# EAGLE schematic TRS-80 (EAGLE 6.6.0)
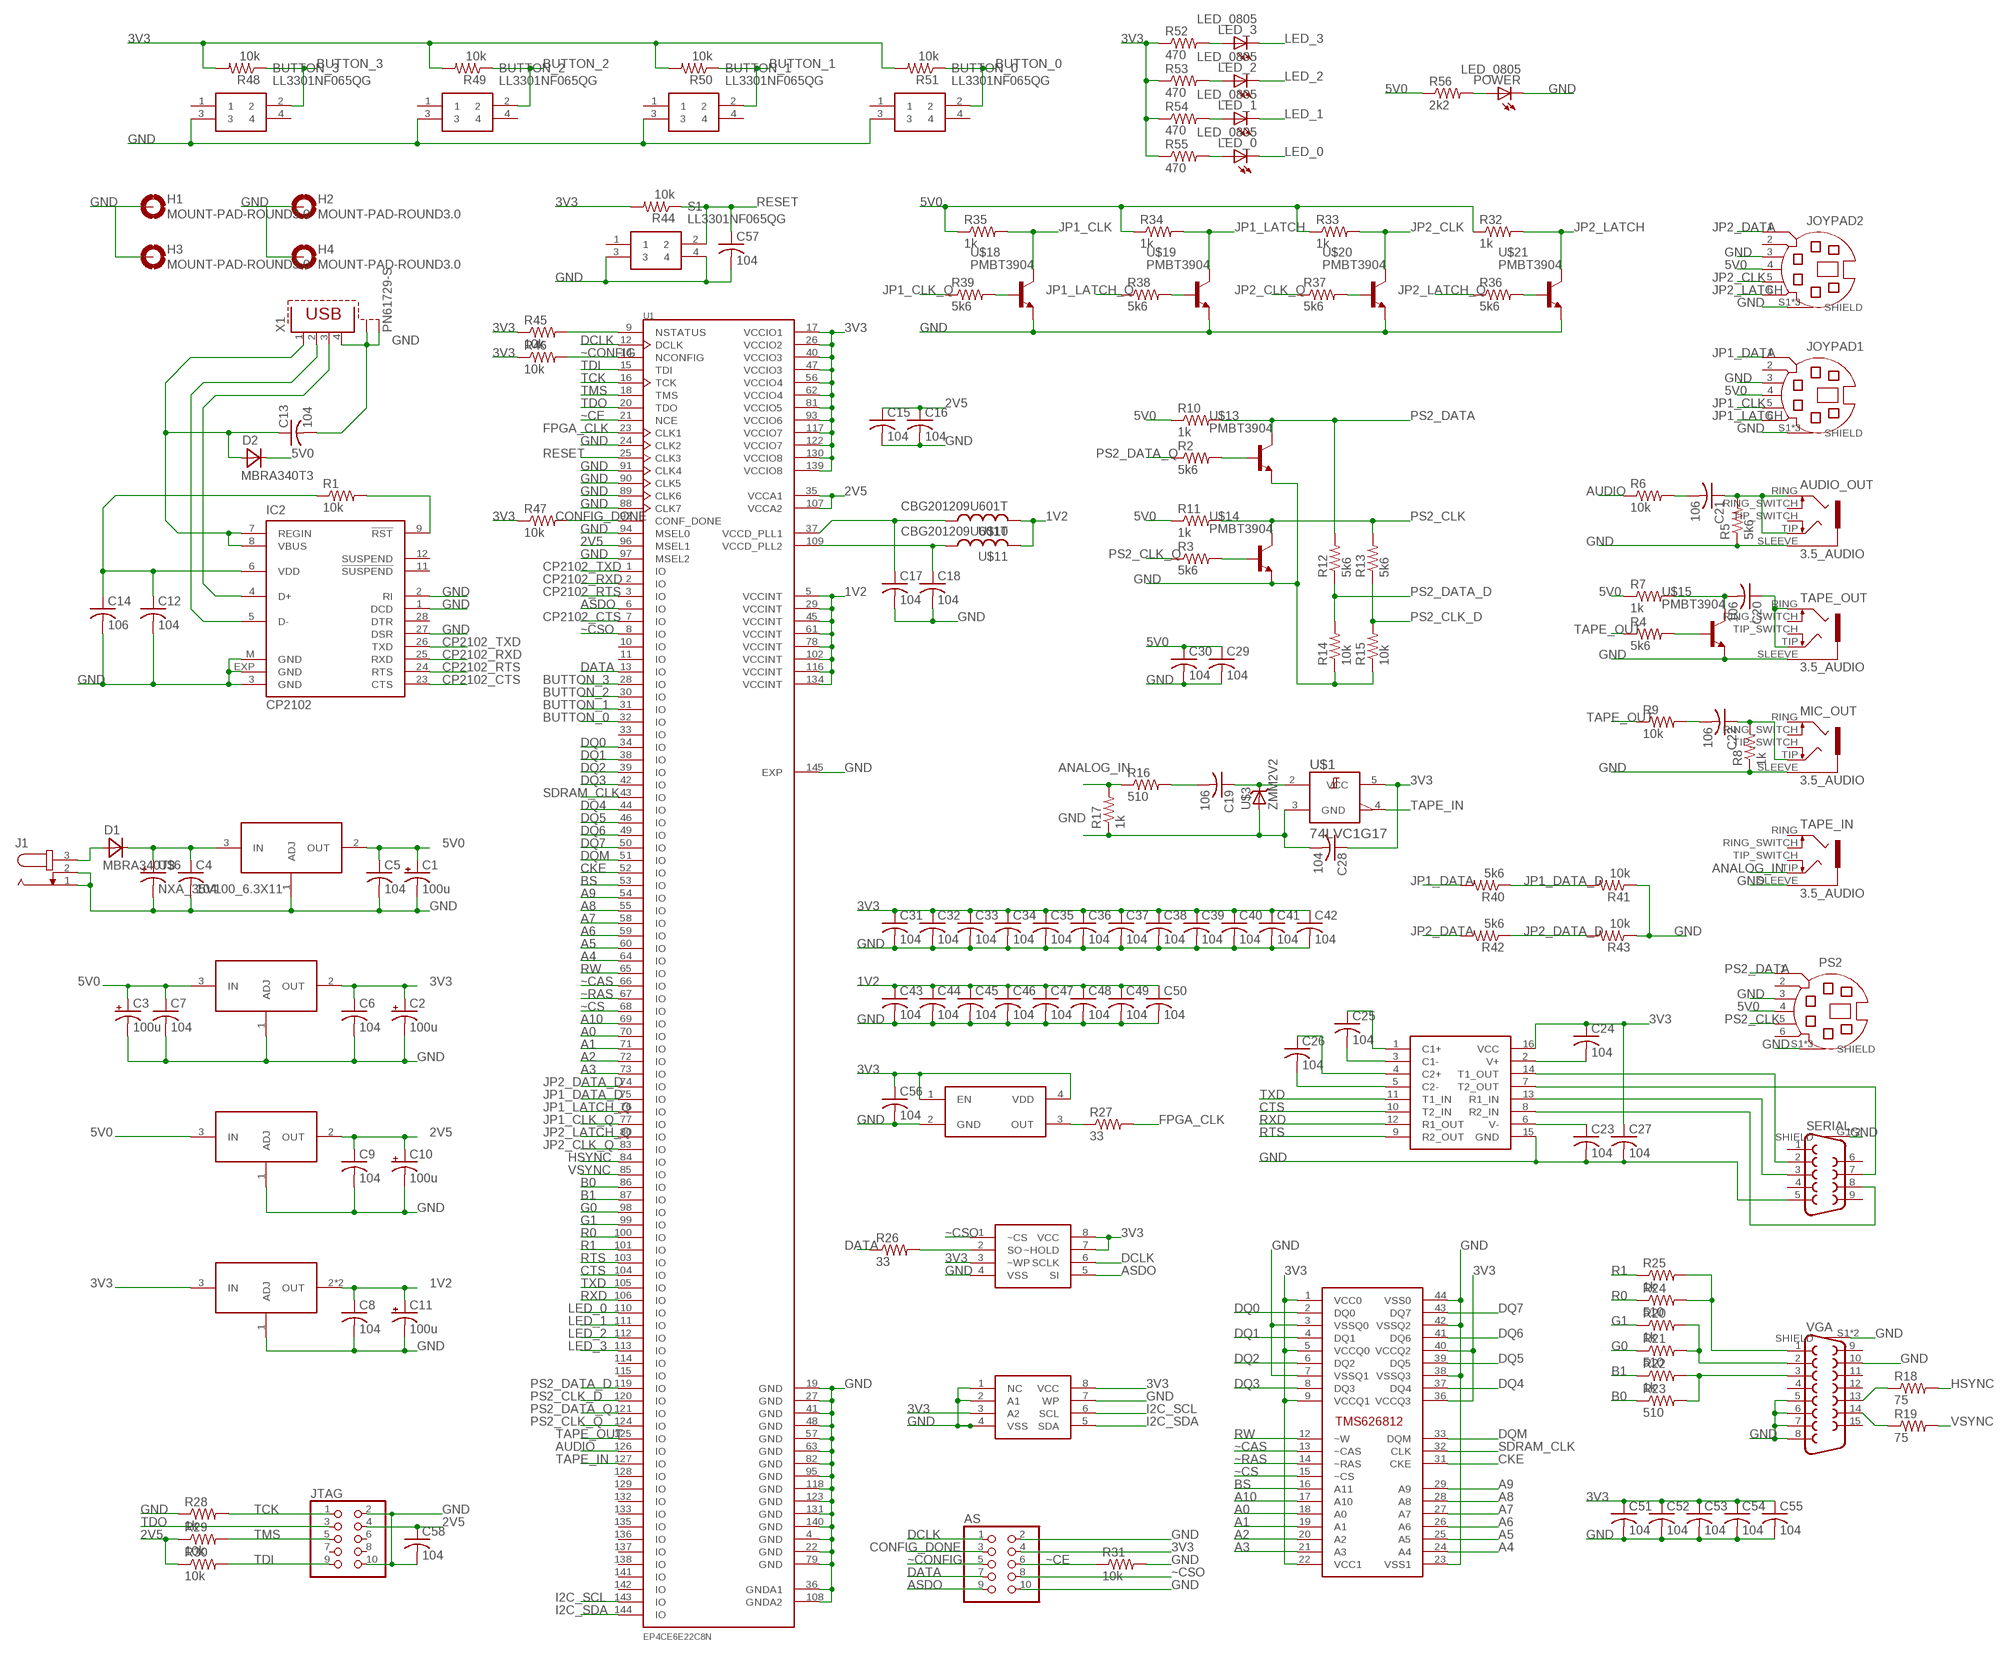
[diagram p0: schematic, sheet 1]

## Parts
AS  PINHD-2X5  [2X05]
AUDIO_OUT  3.5_AUDIO  [3.5_AUDIO]
BUTTON_0  LL3301NF065QG  [LL3301NF065QG]
BUTTON_1  LL3301NF065QG  [LL3301NF065QG]
BUTTON_2  LL3301NF065QG  [LL3301NF065QG]
BUTTON_3  LL3301NF065QG  [LL3301NF065QG]
C1  100u  CPOL-USUD-6,3X5,8  [UD-6,3X5,8_NICHICON]
C2  100u  CPOL-USUD-6,3X5,8  [UD-6,3X5,8_NICHICON]
C3  100u  CPOL-USUD-6,3X5,8  [UD-6,3X5,8_NICHICON]
C4  104  C-USC0805  [C0805]
C5  104  C-USC0805  [C0805]
C6  104  C-USC0805  [C0805]
C7  104  C-USC0805  [C0805]
C8  104  C-USC0805  [C0805]
C9  104  C-USC0805  [C0805]
C10  100u  CPOL-USUD-6,3X5,8  [UD-6,3X5,8_NICHICON]
C11  100u  CPOL-USUD-6,3X5,8  [UD-6,3X5,8_NICHICON]
C12  104  C-USC0805  [C0805]
C13  104  C-USC0805  [C0805]
C14  106  C-USC1206  [C1206]
C15  104  C-USC0805  [C0805]
C16  104  C-USC0805  [C0805]
C17  104  C-USC0805  [C0805]
C18  104  C-USC0805  [C0805]
C19  106  C-USC1206  [C1206]
C20  106  C-USC1206  [C1206]
C21  106  C-USC1206  [C1206]
C22  106  C-USC1206  [C1206]
C23  104  C-USC0805  [C0805]
C24  104  C-USC0805  [C0805]
C25  104  C-USC0805  [C0805]
C26  104  C-USC0805  [C0805]
C27  104  C-USC0805  [C0805]
C28  104  C-USC0805  [C0805]
C29  104  C-USC0805  [C0805]
C30  104  C-USC0805  [C0805]
C31  104  C-USC0805  [C0805]
C32  104  C-USC0805  [C0805]
C33  104  C-USC0805  [C0805]
C34  104  C-USC0805  [C0805]
C35  104  C-USC0805  [C0805]
C36  104  C-USC0805  [C0805]
C37  104  C-USC0805  [C0805]
C38  104  C-USC0805  [C0805]
C39  104  C-USC0805  [C0805]
C40  104  C-USC0805  [C0805]
C41  104  C-USC0805  [C0805]
C42  104  C-USC0805  [C0805]
C43  104  C-USC0805  [C0805]
C44  104  C-USC0805  [C0805]
C45  104  C-USC0805  [C0805]
C46  104  C-USC0805  [C0805]
C47  104  C-USC0805  [C0805]
C48  104  C-USC0805  [C0805]
C49  104  C-USC0805  [C0805]
C50  104  C-USC0805  [C0805]
C51  104  C-USC0805  [C0805]
C52  104  C-USC0805  [C0805]
C53  104  C-USC0805  [C0805]
C54  104  C-USC0805  [C0805]
C55  104  C-USC0805  [C0805]
C56  104  C-USC0805  [C0805]
C57  104  C-USC0805  [C0805]
C58  104  C-USC0805  [C0805]
D1  MBRA340T3  [SMA]
D2  MBRA340T3  [SMA]
H1  MOUNT-PAD-ROUND3.0  [3,0-PAD]
H2  MOUNT-PAD-ROUND3.0  [3,0-PAD]
H3  MOUNT-PAD-ROUND3.0  [3,0-PAD]
H4  MOUNT-PAD-ROUND3.0  [3,0-PAD]
IC2  CP2102  [MLP28]
J1  JACK-PLUG1  [SPC4078]
JOYPAD1  MD06SS  [MDIN06SS]
JOYPAD2  MD06SS  [MDIN06SS]
JTAG  PINHD-2X5  [2X05]
LED_0  LED_0805  [CHIP-LED0805]
LED_1  LED_0805  [CHIP-LED0805]
LED_2  LED_0805  [CHIP-LED0805]
LED_3  LED_0805  [CHIP-LED0805]
MIC_OUT  3.5_AUDIO  [3.5_AUDIO]
POWER  LED_0805  [CHIP-LED0805]
PS2  MD06SS  [MDIN06SS]
R1  10k  R-US_R0805  [R0805]
R2  5k6  R-US_R0805  [R0805]
R3  5k6  R-US_R0805  [R0805]
R4  5k6  R-US_R0805  [R0805]
R5  5k6  R-US_R0805  [R0805]
R6  10k  R-US_R0805  [R0805]
R7  1k  R-US_R0805  [R0805]
R8  1k  R-US_R0805  [R0805]
R9  10k  R-US_R0805  [R0805]
R10  1k  R-US_R0805  [R0805]
R11  1k  R-US_R0805  [R0805]
R12  5k6  R-US_R0805  [R0805]
R13  5k6  R-US_R0805  [R0805]
R14  10k  R-US_R0805  [R0805]
R15  10k  R-US_R0805  [R0805]
R16  510  R-US_R0805  [R0805]
R17  1k  R-US_R0805  [R0805]
R18  75  R-US_R0805  [R0805]
R19  75  R-US_R0805  [R0805]
R20  1k  R-US_R0805  [R0805]
R21  510  R-US_R0805  [R0805]
R22  1k  R-US_R0805  [R0805]
R23  510  R-US_R0805  [R0805]
R24  510  R-US_R0805  [R0805]
R25  1k  R-US_R0805  [R0805]
R26  33  R-US_R0805  [R0805]
R27  33  R-US_R0805  [R0805]
R28  1k  R-US_R0805  [R0805]
R29  10k  R-US_R0805  [R0805]
R30  10k  R-US_R0805  [R0805]
R31  10k  R-US_R0805  [R0805]
R32  1k  R-US_R0805  [R0805]
R33  1k  R-US_R0805  [R0805]
R34  1k  R-US_R0805  [R0805]
R35  1k  R-US_R0805  [R0805]
R36  5k6  R-US_R0805  [R0805]
R37  5k6  R-US_R0805  [R0805]
R38  5k6  R-US_R0805  [R0805]
R39  5k6  R-US_R0805  [R0805]
R40  5k6  R-US_R0805  [R0805]
R41  10k  R-US_R0805  [R0805]
R42  5k6  R-US_R0805  [R0805]
R43  10k  R-US_R0805  [R0805]
R44  10k  R-US_R0805  [R0805]
R45  10k  R-US_R0805  [R0805]
R46  10k  R-US_R0805  [R0805]
R47  10k  R-US_R0805  [R0805]
R48  10k  R-US_R0805  [R0805]
R49  10k  R-US_R0805  [R0805]
R50  10k  R-US_R0805  [R0805]
R51  10k  R-US_R0805  [R0805]
R52  470  R-US_R0805  [R0805]
R53  470  R-US_R0805  [R0805]
R54  470  R-US_R0805  [R0805]
R55  470  R-US_R0805  [R0805]
R56  2k2  R-US_R0805  [R0805]
S1  LL3301NF065QG  [LL3301NF065QG]
SERIAL  F09HP  [F09HP]
TAPE_IN  3.5_AUDIO  [3.5_AUDIO]
TAPE_OUT  3.5_AUDIO  [3.5_AUDIO]
U1  EP4CE6E22C8N  [QFP50P2200X2200X165-145N]
U$1  74LVC1G17  [SOT353]
U$2  TMS626812  [TSOP44-II]
U$3  ZMM2V2  [SOD80C]
U$4  SP232  [SOP16]
U$5  LM1086  [D2PACK]
U$6  NXA_35V100_6.3X11  [NXA_35V100_6.3X11]
U$7  LD1117D-3.3  [TO252]
U$8  KIA1117-2.5  [SOT223]
U$9  AZ1117H-1.2TRG1  [SOT223]
U$10  CBG201209U601T  [C0805]
U$11  CBG201209U601T  [C0805]
U$12  OT705050MJBA4SL  [ASV32000MHZET]
U$13  PMBT3904  [SOT23]
U$14  PMBT3904  [SOT23]
U$15  PMBT3904  [SOT23]
U$16  BY25Q16BS  [SO08]
U$17  CAT24M01WI-GT3  [SO08]
U$18  PMBT3904  [SOT23]
U$19  PMBT3904  [SOT23]
U$20  PMBT3904  [SOT23]
U$21  PMBT3904  [SOT23]
VGA  F15HDH  [HDF15H]
X1  PN61729-S  [PN61729-S]

## Nets
1V2: C8.1 C11.+ C43.1 C44.1 C45.1 C46.1 C47.1 C48.1 C49.1 C50.1 U1.5(VCCINT) U1.29(VCCINT) U1.45(VCCINT) U1.61(VCCINT) U1.78(VCCINT) U1.102(VCCINT) U1.116(VCCINT) U1.134(VCCINT) U$9.2(OUT) U$9.4(OUT) U$10.2 U$11.2
2V5: C9.1 C10.+ C15.1 C16.1 C58.1 JTAG.4 R29.1 R30.1 U1.35(VCCA1) U1.96(MSEL1) U1.107(VCCA2) U$8.2(OUT)
3V3: AS.4 C2.+ C6.1 C24.1 C27.1 C28.1 C31.1 C32.1 C33.1 C34.1 C35.1 C36.1 C37.1 C38.1 C39.1 C40.1 C41.1 C42.1 C51.1 C52.1 C53.1 C54.1 C55.1 C56.1 R44.2 R45.1 R46.1 R47.1 R48.2 R49.2 R50.2 R51.2 R52.1 R53.1 R54.1 R55.1 U1.17(VCCIO1) U1.26(VCCIO2) U1.40(VCCIO3) U1.47(VCCIO3) U1.56(VCCIO4) U1.62(VCCIO4) U1.81(VCCIO5) U1.93(VCCIO6) U1.117(VCCIO7) U1.122(VCCIO7) U1.130(VCCIO8) U1.139(VCCIO8) U$1.5(VCC) U$2.1(VCC0) U$2.5(VCCQ0) U$2.9(VCCQ1) U$2.22(VCC1) U$2.36(VCCQ3) U$2.40(VCCQ2) U$4.16(VCC) U$7.2(OUT) U$9.3(IN) U$12.1(EN) U$12.4(VDD) U$16.3(~WP) U$16.7(~HOLD) U$16.8(VCC) U$17.3(A2) U$17.8(VCC)
5V0: C1.+ C3.+ C5.1 C7.1 C29.1 C30.1 D2.C JOYPAD1.4 JOYPAD2.4 PS2.4 R7.1 R10.1 R11.1 R32.1 R33.1 R34.1 R35.1 R56.1 U$5.2(OUT) U$7.3(IN) U$8.3(IN)
A0: U1.70(IO) U$2.18(A0)
A1: U1.71(IO) U$2.19(A1)
A2: U1.72(IO) U$2.20(A2)
A3: U1.73(IO) U$2.21(A3)
A4: U1.64(IO) U$2.24(A4)
A5: U1.60(IO) U$2.25(A5)
A6: U1.59(IO) U$2.26(A6)
A7: U1.58(IO) U$2.27(A7)
A8: U1.55(IO) U$2.28(A8)
A9: U1.54(IO) U$2.29(A9)
A10: U1.69(IO) U$2.17(A10)
ANALOG_IN: R16.1 R17.2 TAPE_IN.TIP
ASDO: AS.9 U1.6(IO) U$16.5(SI)
AUDIO: R6.1 U1.126(IO)
B0: R23.1 U1.86(IO)
B1: R22.1 U1.87(IO)
BS: U1.53(IO) U$2.16(A11)
BUTTON_0: BUTTON_0.2 R51.1 U1.32(IO)
BUTTON_1: BUTTON_1.2 R50.1 U1.31(IO)
BUTTON_2: BUTTON_2.2 R49.1 U1.30(IO)
BUTTON_3: BUTTON_3.2 R48.1 U1.28(IO)
CKE: U1.52(IO) U$2.31(CKE)
CONFIG_DONE: AS.3 R47.2 U1.92(CONF_DONE)
CP2102_CTS: IC2.23(CTS) U1.7(IO)
CP2102_RTS: IC2.24(RTS) U1.3(IO)
CP2102_RXD: IC2.25(RXD) U1.2(IO)
CP2102_TXD: IC2.26(TXD) U1.1(IO)
CTS: U1.104(IO) U$4.10(T2_IN)
DATA: AS.7 R26.1 U1.13(IO)
DCLK: AS.1 U1.12(DCLK) U$16.6(SCLK)
DQ0: U1.34(IO) U$2.2(DQ0)
DQ1: U1.38(IO) U$2.4(DQ1)
DQ2: U1.39(IO) U$2.6(DQ2)
DQ3: U1.42(IO) U$2.8(DQ3)
DQ4: U1.44(IO) U$2.37(DQ4)
DQ5: U1.46(IO) U$2.39(DQ5)
DQ6: U1.49(IO) U$2.41(DQ6)
DQ7: U1.50(IO) U$2.43(DQ7)
DQM: U1.51(IO) U$2.33(DQM)
FPGA_CLK: R27.2 U1.23(CLK1)
G0: R21.1 U1.98(IO)
G1: R20.1 U1.99(IO)
GND: AS.2 AS.10 AUDIO_OUT.SLEEVE BUTTON_0.3 BUTTON_1.3 BUTTON_2.3 BUTTON_3.3 C1.- C2.- C3.- C4.2 C5.2 C6.2 C7.2 C8.2 C9.2 C10.- C11.- C12.2 C13.2 C14.2 C15.2 C16.2 C17.2 C18.2 C23.2 C27.2 C28.2 C29.2 C30.2 C31.2 C32.2 C33.2 C34.2 C35.2 C36.2 C37.2 C38.2 C39.2 C40.2 C41.2 C42.2 C43.2 C44.2 C45.2 C46.2 C47.2 C48.2 C49.2 C50.2 C51.2 C52.2 C53.2 C54.2 C55.2 C56.2 C57.2 C58.2 H1.B3,0(MOUNT) H2.B3,0(MOUNT) H3.B3,0(MOUNT) H4.B3,0(MOUNT) IC2.1(DCD) IC2.2(RI) IC2.3(GND) IC2.27(DSR) IC2.EXP(GND) IC2.M(GND) J1.1 J1.2 JOYPAD1.3 JOYPAD1.S1(SHIELD) JOYPAD1.S2(SHIELD) JOYPAD1.S3(SHIELD) JOYPAD2.3 JOYPAD2.S1(SHIELD) JOYPAD2.S2(SHIELD) JOYPAD2.S3(SHIELD) JTAG.2 JTAG.10 MIC_OUT.SLEEVE POWER.C PS2.3 PS2.S1(SHIELD) PS2.S2(SHIELD) PS2.S3(SHIELD) R5.1 R8.1 R14.1 R15.1 R17.1 R28.1 R31.2 R41.1 R43.1 S1.3 S1.4 SERIAL.5 SERIAL.G1(SHIELD) SERIAL.G2(SHIELD) TAPE_IN.SLEEVE TAPE_OUT.SLEEVE U1.4(GND) U1.19(GND) U1.22(GND) U1.24(CLK2) U1.27(GND) U1.36(GNDA1) U1.41(GND) U1.48(GND) U1.57(GND) U1.63(GND) U1.79(GND) U1.82(GND) U1.88(CLK7) U1.89(CLK6) U1.90(CLK5) U1.91(CLK4) U1.94(MSEL0) U1.95(GND) U1.97(MSEL2) U1.108(GNDA2) U1.118(GND) U1.123(GND) U1.131(GND) U1.140(GND) U1.145(EXP) U$1.3(GND) U$2.3(VSSQ0) U$2.7(VSSQ1) U$2.23(VSS1) U$2.38(VSSQ3) U$2.42(VSSQ2) U$2.44(VSS0) U$3.A U$4.15(GND) U$5.1(ADJ) U$6.P$1(-) U$7.1(ADJ) U$8.1(ADJ) U$9.1(ADJ) U$12.2(GND) U$13.2(E) U$14.2(E) U$15.2(E) U$16.4(VSS) U$17.1(NC) U$17.2(A1) U$17.4(VSS) U$17.7(WP) U$18.2(E) U$19.2(E) U$20.2(E) U$21.2(E) VGA.5 VGA.6 VGA.7 VGA.8 VGA.10 VGA.S1(SHIELD) VGA.S2(SHIELD) X1.4 X1.S1 X1.S2
HSYNC: R18.2 U1.84(IO)
I2C_SCL: U1.143(IO) U$17.6(SCL)
I2C_SDA: U1.144(IO) U$17.5(SDA)
JP1_CLK: JOYPAD1.5 R35.2 U$18.3(C)
JP1_CLK_Q: R39.1 U1.77(IO)
JP1_DATA: JOYPAD1.1 R40.2
JP1_DATA_D: R40.1 R41.2 U1.75(IO)
JP1_LATCH: JOYPAD1.6 R34.2 U$19.3(C)
JP1_LATCH_Q: R38.1 U1.76(IO)
JP2_CLK: JOYPAD2.5 R33.2 U$20.3(C)
JP2_CLK_Q: R37.1 U1.83(IO)
JP2_DATA: JOYPAD2.1 R42.2
JP2_DATA_D: R42.1 R43.2 U1.74(IO)
JP2_LATCH: JOYPAD2.6 R32.2 U$21.3(C)
JP2_LATCH_Q: R36.1 U1.80(IO)
LED_0: LED_0.C U1.110(IO)
LED_1: LED_1.C U1.111(IO)
LED_2: LED_2.C U1.112(IO)
LED_3: LED_3.C U1.113(IO)
N$1: C17.1 U1.37(VCCD_PLL1) U$10.1
N$2: IC2.5(D-) X1.2
N$3: IC2.4(D+) X1.3
N$4: IC2.9(!RST) R1.2
N$5: LED_3.A R52.2
N$6: C18.1 U1.109(VCCD_PLL2) U$11.1
N$7: C12.1 C14.1 IC2.6(VDD) R1.1
N$8: R2.2 U$13.1(B)
N$9: R3.2 U$14.1(B)
N$10: R4.2 U$15.1(B)
N$11: C22.1 MIC_OUT.TIP R8.2
N$12: C20.2 R7.2 U$15.3(C)
N$13: C19.1 U$1.2(A) U$3.C
N$14: AUDIO_OUT.RING AUDIO_OUT.TIP C21.1 R5.2
N$15: C19.2 R16.2
N$16: C20.1 TAPE_OUT.RING TAPE_OUT.TIP
N$17: C21.2 R6.2
N$18: R18.1 VGA.13
N$19: R19.1 VGA.14
N$20: R22.2 R23.2 VGA.3
N$21: R20.2 R21.2 VGA.2
N$22: R24.2 R25.2 VGA.1
N$23: C22.2 R9.2
N$24: SERIAL.2 U$4.14(T1_OUT)
N$25: SERIAL.3 U$4.13(R1_IN)
N$26: SERIAL.8 U$4.8(R2_IN)
N$27: SERIAL.7 U$4.7(T2_OUT)
N$28: C23.1 U$4.6(V-)
N$30: C24.2 U$4.2(V+)
N$32: C25.2 U$4.3(C1-)
N$33: C25.1 U$4.1(C1+)
N$34: C26.1 U$4.4(C2+)
N$35: C26.2 U$4.5(C2-)
N$37: R26.2 U$16.2(SO)
N$38: R27.1 U$12.3(OUT)
N$39: LED_2.A R53.2
N$40: LED_1.A R54.2
N$41: LED_0.A R55.2
N$42: R39.2 U$18.1(B)
N$43: R38.2 U$19.1(B)
N$44: R37.2 U$20.1(B)
N$45: R36.2 U$21.1(B)
N$46: POWER.A R56.2
N$50: R45.2 U1.9(NSTATUS)
PS2_CLK: PS2.5 R11.2 R13.2 U$14.3(C)
PS2_CLK_D: R13.1 R15.2 U1.120(IO)
PS2_CLK_Q: R3.1 U1.124(IO)
PS2_DATA: PS2.1 R10.2 R12.2 U$13.3(C)
PS2_DATA_D: R12.1 R14.2 U1.119(IO)
PS2_DATA_Q: R2.1 U1.121(IO)
R0: R24.1 U1.100(IO)
R1: R25.1 U1.101(IO)
RESET: C57.1 R44.1 S1.2 U1.25(CLK3)
RTS: U1.103(IO) U$4.9(R2_OUT)
RW: U1.65(IO) U$2.12(~W)
RXD: U1.106(IO) U$4.12(R1_OUT)
SDRAM_CLK: U1.43(IO) U$2.32(CLK)
TAPE_IN: U1.127(IO) U$1.4(Y)
TAPE_OUT: R4.1 R9.1 U1.125(IO)
TCK: JTAG.1 R28.2 U1.16(TCK)
TDI: JTAG.9 R30.2 U1.15(TDI)
TDO: JTAG.3 U1.20(TDO)
TMS: JTAG.5 R29.2 U1.18(TMS)
TXD: U1.105(IO) U$4.11(T1_IN)
VBUS: C13.1 D2.A IC2.7(REGIN) IC2.8(VBUS) X1.1
VHIGH: C4.1 D1.C U$5.3(IN) U$6.P$2(+)
VIN: D1.A J1.3
VSYNC: R19.2 U1.85(IO)
~CAS: U1.66(IO) U$2.13(~CAS)
~CE: AS.6 R31.1 U1.21(NCE)
~CONFIG: AS.5 R46.2 U1.14(NCONFIG)
~CS: U1.68(IO) U$2.15(~CS)
~CSO: AS.8 U1.8(IO) U$16.1(~CS)
~RAS: U1.67(IO) U$2.14(~RAS)
Unconnected: AUDIO_OUT.RING_SWITCH AUDIO_OUT.TIP_SWITCH BUTTON_0.1 BUTTON_0.4 BUTTON_1.1 BUTTON_1.4 BUTTON_2.1 BUTTON_2.4 BUTTON_3.1 BUTTON_3.4 IC2.11(!SUSPEND) IC2.12(SUSPEND) IC2.28(DTR) JOYPAD1.2 JOYPAD2.2 JTAG.6 JTAG.7 JTAG.8 MIC_OUT.RING MIC_OUT.RING_SWITCH MIC_OUT.TIP_SWITCH PS2.2 PS2.6 S1.1 SERIAL.1 SERIAL.4 SERIAL.6 SERIAL.9 TAPE_IN.RING TAPE_IN.RING_SWITCH TAPE_IN.TIP_SWITCH TAPE_OUT.RING_SWITCH TAPE_OUT.TIP_SWITCH U1.10(IO) U1.11(IO) U1.33(IO) U1.114(IO) U1.115(IO) U1.128(IO) U1.129(IO) U1.132(IO) U1.133(IO) U1.135(IO) U1.136(IO) U1.137(IO) U1.138(IO) U1.141(IO) U1.142(IO) VGA.4 VGA.9 VGA.11 VGA.12 VGA.15

## Library data of the parts
AS JTAG = Signetics:PINHD-2X5: PIN HEADER
AUDIO_OUT MIC_OUT TAPE_IN TAPE_OUT = Signetics:3.5_AUDIO
BUTTON_0 BUTTON_1-BUTTON_3 S1 = Signetics:LL3301NF065QG: E-SWITCH - LL3301NF065QG - TACTILE SW, SPST, 0.05A, 12VDC, SOLDER Source: Datasheet <http://spec_sheets.e-switch.com/specs/P090002.pdf>; DESCRIPTION: E-SWITCH - LL3301NF065QG - TACTILE SW, SPST, 0.05A, 12VDC, SOLDER; HEIGHT: 4mm; MANUFACTURER_NAME: E-Switch; MANUFACTURER_PART_NUMBER: LL3301NF065QG; MOUSER_PART_NUMBER: 612-LL3301NF065QG; MOUSER_PRICE-STOCK: https://www.mouser.co.uk/ProductDetail/E-Switch/LL3301NF065QG?qs=QtyuwXswaQiWhwgY68YTTw%3D%3D
C1-C3 C10 C11 = rcl:CPOL-US: POLARIZED CAPACITOR, American symbol
C4-C9 C12-C58 = rcl:C-US: CAPACITOR, American symbol
D1 D2 = diode:MBRA340T3: Surface Mount Schottky Power Rectifier Source: http://www.onsemi.com/pub_link/Collateral/MBRA340T3-D.PDF
H1-H4 = holes:MOUNT-PAD-ROUND: MOUNTING PAD, round
IC2 = silabs:CP210*: Single-Chip USB to UART Bridge Source: www.silabs.com .. CP2101.pdf / cp2102.pdf; MF: FARNELL; MPN: CP2102-GM; OC_FARNELL: 9282130; OC_NEWARK: 30K5635
J1 = con-jack:JACK-PLUG: DC POWER JACK Power Jack, DC, Right Angle, Through Hole, Rated 5A at 16VDC, PC Terminals Distributor: Farnell (www.Farnell.de) Drawing: 84N1161.pdf / 84N1162.pdf Manufacturer: SPC Technology (www.spctechnology.com) Type: SPC4077 / SPC 4078; OC_FARNELL: unknown; OC_NEWARK: unknown
JOYPAD1 JOYPAD2 PS2 = con-yamaichi:MD06SS: YAMAICHI CONNECTOR; OC_FARNELL: unknown; OC_NEWARK: unknown
LED_0 LED_1-LED_3 POWER = Signetics:LED_0805
R1-R56 = rcl:R-US_: RESISTOR, American symbol
SERIAL = con-subd:F09: SUB-D; OC_FARNELL: unknown; OC_NEWARK: unknown
U1 = Signetics:EP4CE6E22C8N: Ic Cyclone Iv Fpga 6k 144eqfp - Ep4ce6e22c8n Check prices <https://pricing.snapeda.com/parts/EP4CE6E22C8N/Intel/view-part?ref=eda>; AVAILABILITY: Warning; DESCRIPTION: IC FPGA 91 I/O 144EQFP; MF: Intel; MP: EP4CE6E22C8N; PACKAGE: LQFP-144 Intel; PRICE: None; PURCHASE-URL: https://pricing.snapeda.com/search/part/EP4CE6E22C8N/?ref=eda
U$1 = Signetics:74LVC1G17
U$2 = Signetics:TMS626812
U$3 = Signetics:ZMM2V2
U$4 = Signetics:SP232
U$5 = Signetics:LM1086
U$6 = Signetics:NXA_35V100_6.3X11
U$7 = Signetics:LD1117D-3.3
U$8 = Signetics:KIA1117-2.5
U$9 = Signetics:AZ1117H-1.2TRG1
U$10 U$11 = Signetics:CBG201209U601T
U$12 = Signetics:OT705050MJBA4SL
U$13-U$15 U$18-U$21 = Signetics:PMBT3904
U$16 = Signetics:BY25Q16BS
U$17 = Signetics:CAT24M01WI-GT3
VGA = con-subd:F15: SUB-D; OC_FARNELL: unknown; OC_NEWARK: unknown
X1 = con-berg:PN61729-S: BERG USB connector; OC_FARNELL: unknown; OC_NEWARK: unknown